# Altium project Ger. abastecimento.PrjPcb
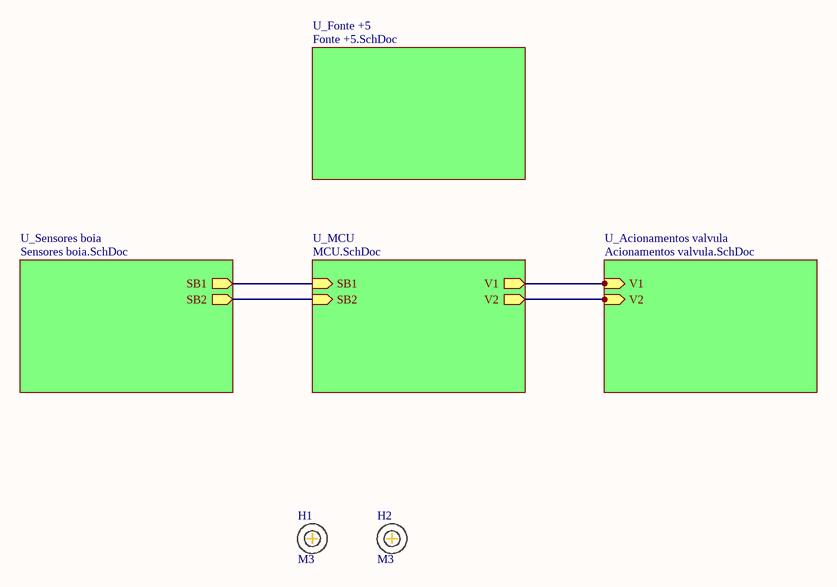
[diagram p0: Main.SchDoc]
ApprovedBy: Douglas Felipé; =ProjectName: Ger. abastecimento
5 sheets, 43 parts. Net scope: hierarchical (ports join the sheet entries above them; power ports are global).
Board file: PCB Ger_Abs.PcbDoc
Sheets:
  Main.SchDoc
    U_Acionamentos valvula = Acionamentos valvula.SchDoc
    U_Fonte +5 = Fonte +5.SchDoc
    U_MCU = MCU.SchDoc
    U_Sensores boia = Sensores boia.SchDoc

## Sheet Main.SchDoc: Main
size A4; ApprovedBy: Douglas Felipe; Author: Douglas Felipe; DocumentNumber: GERABS01; Revision: 1.0; SheetNumber: 1; SheetTotal: 5

### Parts
H1  M3  [Parafuso M2]
H2  M3  [Parafuso M2]

### Sub-sheets
U_Acionamentos valvula = Acionamentos valvula.SchDoc: V1 (in), V2 (in)
U_Fonte +5 = Fonte +5.SchDoc: no entries
U_MCU = MCU.SchDoc: SB1 (in), SB2 (in), V1 (out), V2 (out)
U_Sensores boia = Sensores boia.SchDoc: SB1 (out), SB2 (out)

### Nets
NetC6_1: sheet U_MCU/SB1, sheet U_Sensores boia/SB1
NetC8_1: sheet U_MCU/SB2, sheet U_Sensores boia/SB2
NetR5_1: sheet U_Acionamentos valvula/V1, sheet U_MCU/V1
NetR6_1: sheet U_Acionamentos valvula/V2, sheet U_MCU/V2

### Notes on the sheet
- PROJETO
- REV
- TITULO
- PÁG
- DE
- NÚMERO
- DESIGNER
- REVISADO POR
- DATA
- ARQUIVO
- TAMANHO
- A4

### Library data of the parts
H1 H2 = Furo M2

## Sheet Acionamentos valvula.SchDoc: Acionamento valvulas
size A4; Date: 22/04/2023; ApprovedBy: Douglas F.; Author: Douglas F.; DocumentNumber: GERABS01; Revision: 1.0; SheetNumber: 3; SheetTotal: 4; Application_BuildNumber: GerAbs01
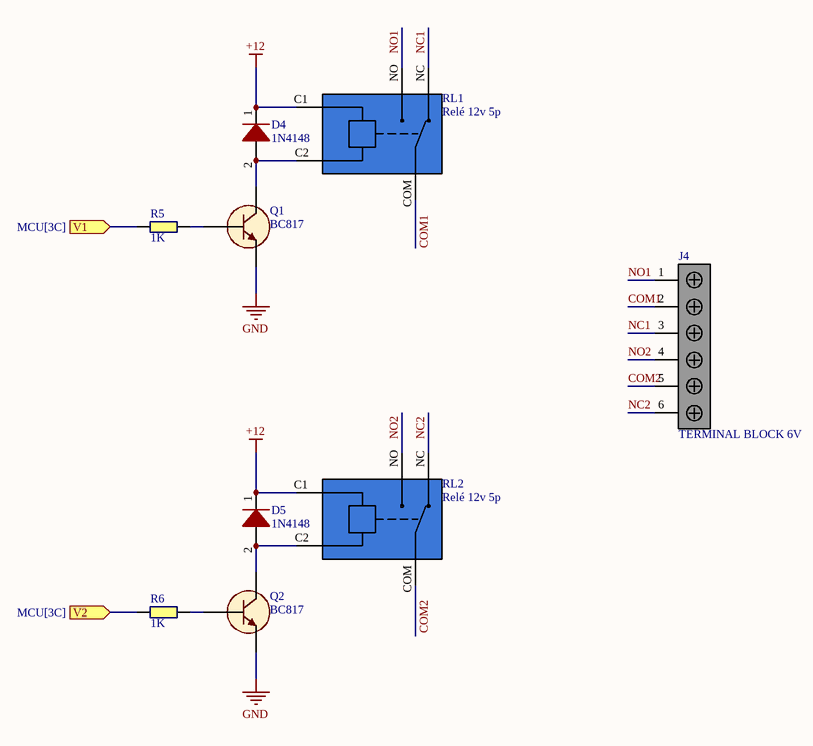
[diagram p1: Acionamentos valvula.SchDoc]

### Parts
D4  1N4148  [DIOMELF3516N]
D5  1N4148  [DIOMELF3516N]
J4  TERMINAL BLOCK 6V  [Terminal block 5mm 6V]
Q1  BC817  [SOT23]
Q2  BC817  [SOT23]
R5  1K  [RESISTOR 1/4W 0805]
R6  1K  [RESISTOR 1/4W 0805]
RL1  Relé 12v 5p  [RELAY]
RL2  Relé 12v 5p  [RELAY]

### Ports
V1 (in, see MCU[3C]), V2 (in, see MCU[3C])

### Nets
+12: D4.1 D5.1 RL1.C1(COIL_1) RL2.C1(COIL_1)
GND: Q1.2(E) Q2.2(E)
COM1: J4.2 RL1.COM
COM2: J4.5 RL2.COM
NC1: J4.3 RL1.NC
NC2: J4.6 RL2.NC
NO1: J4.1 RL1.NO
NO2: J4.4 RL2.NO
NetD4_2: D4.2 Q1.3(C) RL1.C2(COIL_2)
NetD5_2: D5.2 Q2.3(C) RL2.C2(COIL_2)
NetQ1_1: Q1.1(B) R5.2
NetQ2_1: Q2.1(B) R6.2
NetR5_1: R5.1 ; port V1
NetR6_1: R6.1 ; port V2

### Notes on the sheet
- PROJETO
- REV
- TITULO
- PÁG
- DE
- NÚMERO
- DESIGNER
- REVISADO POR
- DATA
- ARQUIVO
- TAMANHO
- A4

### Library data of the parts
D4 D5 = DIODO 1N4148: Diodo rapido; Published: 8-Jun-2000; LatestRevisionDate: 17-Jul-2002; LatestRevisionNote: Re-released for DXP Platform.; DatasheetVersion: 1997; PackageReference: DO-35; Publisher: Altium Limited; PackageDescription: Diode, Axial; Body 3.8 x 1.9 mm (LxDia. max), Lead Dia. 0.53 mm (max); Code_JEDEC: DO-204-AH; ComponentLink1Description: Manufacturer Link; ComponentLink1URL: http://www.fairchildsemi.com/; ComponentLink2Description: Datasheet; ComponentLink2URL: http://www.fairchildsemi.com/ds/1N%2F1N4148.pdf
J4 = TERMINAL BLOCK 6V: Block, Terminal; 6 A; 63 V; 5 mm; 26 to 20 AWG; 6 Screw; Soldering; 1.5 kV
R5 R6 = RESISTOR 1/4W: Resistor; Published: 8-Jun-2000; LatestRevisionDate: 17-Jul-2002; LatestRevisionNote: Re-released for DXP Platform.; PackageReference: AXIAL-0.4; Publisher: Altium Limited; PackageDescription: Axial Device, Thru-Hole; 2 Leads; 0.4 in Pin Spacing

## Sheet Fonte +5.SchDoc: Fonte regulas + 5v
size A4; Date: 22/04/2023; ApprovedBy: Douglas Felipe; Author: Douglas Felipe; DocumentNumber: GERABS01; Revision: 1.0; SheetNumber: 2; SheetTotal: 5
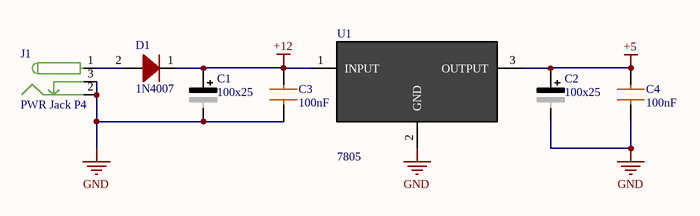
[diagram p2: Fonte +5.SchDoc]

### Parts
C1  100x25  [CAP 100X25 SMD]
C2  100x25  [CAP 100X25 SMD]
C3  100nF  [Capacitor 0805]
C4  100nF  [Capacitor 0805]
D1  1N4007  [SOD123]
J1  PWR Jack P4  [Jack P4 SMT]
U1  7805  [TO252-3]

### Nets
+5: C2.1(+) C4.2 U1.3(OUTPUT)
+12: C1.1(+) C3.2 D1.1 U1.1(INPUT)
GND: C1.2(-) C2.2(-) C3.1 C4.1 J1.2 J1.3 U1.2(GND)
NetD1_2: D1.2 J1.1

### Notes on the sheet
- PROJETO
- REV
- TITULO
- PÁG
- DE
- NÚMERO
- DESIGNER
- REVISADO POR
- DATA
- ARQUIVO
- TAMANHO
- A4

### Library data of the parts
C1 C2 = CAPACITOR ELETROLITICO: Polarized Capacitor (Radial); Published: 8-Jun-2000; LatestRevisionDate: 17-Jul-2002; LatestRevisionNote: Re-released for DXP Platform.; PackageReference: RB7.6-15; Publisher: Altium Limited; PackageDescription: Polarized Capacitor (Radial); 2 Leads
C3 C4 = CAPACITOR: Published: 8-Jun-2000; LatestRevisionDate: 17-Jul-2002; LatestRevisionNote: Re-released for DXP Platform.; PackageReference: RAD-0.3; Publisher: Altium Limited; PackageDescription: Radial Cap, Thru-Hole; 2 Leads; 0.3 in Pin Spacing
D1 = DIODO 1N4007: Diodo retificador de uso geral.; Published: 8-Jun-2000; LatestRevisionDate: 17-Jul-2002; LatestRevisionNote: Re-released for DXP Platform.; DatasheetVersion: 1997; PackageReference: DO-35; Publisher: Altium Limited; PackageDescription: Diode, Axial; Body 3.8 x 1.9 mm (LxDia. max), Lead Dia. 0.53 mm (max); Code_JEDEC: DO-204-AH; ComponentLink1Description: Manufacturer Link; ComponentLink1URL: http://www.fairchildsemi.com/; ComponentLink2Description: Datasheet; ComponentLink2URL: http://www.fairchildsemi.com/ds/1N%2F1N4148.pdf
J1 = PWR Jack P4: Connector Power PL 2 POS Solder RA Thru-Hole 3 Terminal 1 Port Bulk; Manufacturer: Switchcraft; Manufacturer Part Number: RAPC712X; Body Color: Black; Body Material: Thermoplastic; Number of Terminals/Pins: 3; Gender: Male; Shielding: Unshielded; Connector Type: Power,Jack; Current Rating: 5A; Insulation Resistance: 30MR; Number of Contacts: 2; Number of Ports: 1; Pin Diameter: 2.5mm; RoHS: Yes; Category: Connectors; Stock 1: 13399; Pricing 1: 1=1,91000, 10=1,33000, 50=1,33000, 100=1,23000, 1000=1,06000, 10000=1,04000 (USD); Mount: Through Hole,PCB,Panel; Number of Pins: 3; Contact Material: Brass; Contact Plating: Nickel,Silver; Housing Material: Thermoplastic; Color: Black; Housing Color: Black; Packaging: Bulk; Termination: Solder; Package Quantity: 2500; Orientation: Right Angle; Series: -; Contact Gender: Female; Max Current Rating: 5A; Primary Type: POWER; Length: 9mm; Depth: 14.5mm; Lead Free: Lead Free; Flammability Rating: UL94 V-0; RoHS Compliant: Yes; Reach SVHC Compliant: Yes; ComponentLink1URL: https://datasheet.ciiva.com/15173/getdatasheetpartid-110865-15173793.pdf?src-supplier=Verical; ComponentLink1Description: https://datasheet.ciiva.com/15173/getdatasheetpartid-110865-15173793.pdf?src-supplier=Verical; ComponentLink2URL: https://datasheet.ciiva.com/391/rapc712x-cd-391666.pdf?src-supplier=Digi-Key; ComponentLink2Description: https://datasheet.ciiva.com/391/rapc712x-cd-391666.pdf?src-supplier=Digi-Key; Supplier Part Number 1: 502-RAPC712X
U1 = L7805

## Sheet MCU.SchDoc: MCU
size A4; Date: 22/04/2023; ApprovedBy: Douglas Felipe; Author: Douglas Felipe; DocumentNumber: GERABS01; Revision: 1.0; SheetNumber: 5; SheetTotal: 5; Application_BuildNumber: 1.0
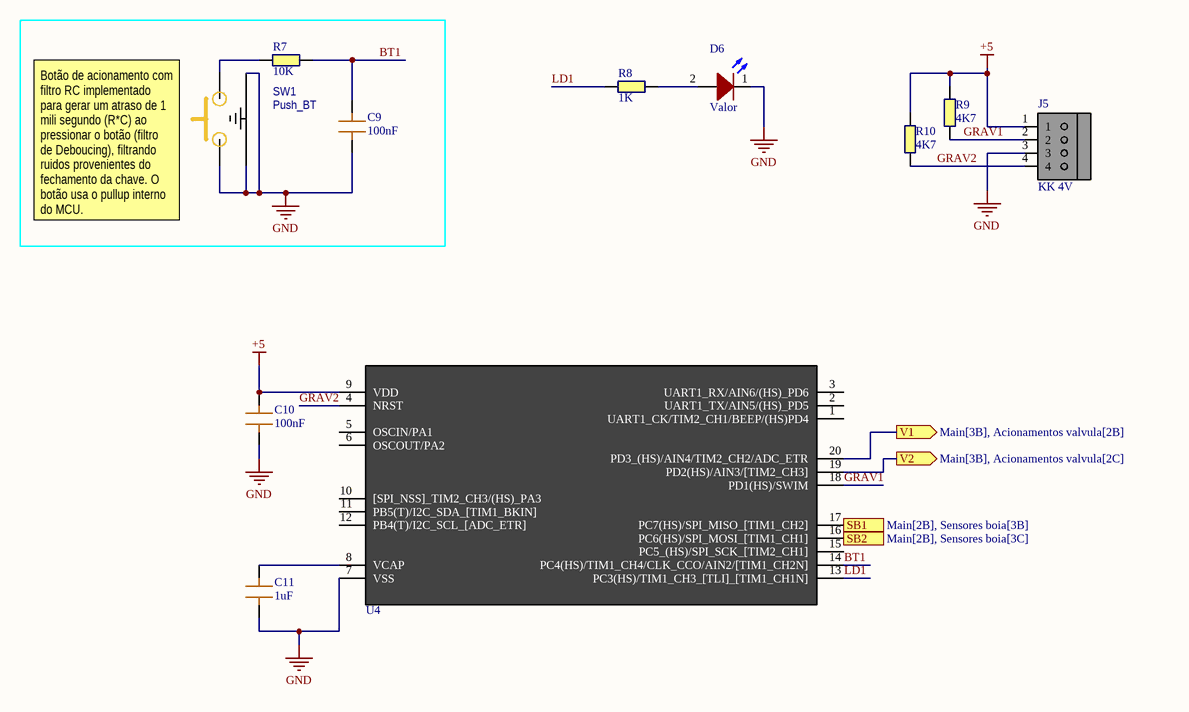
[diagram p3: MCU.SchDoc]

### Parts
C9  100nF  [Capacitor 0805]
C10  100nF  [Capacitor 0805]
C11  1uF  [Capacitor 0805]
D6  Valor  [LED 3MM]
J5  KK 4V  [CONN KK 4 VIAS]
R7  10K  [RESISTOR 1/4W 0805]
R8  1K  [RESISTOR 1/4W 0805]
R9  4K7  [RESISTOR 1/4W 0805]
R10  4K7  [RESISTOR 1/4W 0805]
SW1  Push_BT  [SWITCH 9.5 180]
U4  STM8S003F3P6  [SOP65P640X170-20N]  (value not drawn)

### Ports
SB1 (in, see Main[2B], Sensores boia[3B]), SB2 (in, see Main[2B], Sensores boia[3C]), V1 (out, see Main[3B], Acionamentos valvula[2B]), V2 (out, see Main[3B], Acionamentos valvula[2C])

### Nets
+5: C10.1 J5.1 R9.1 R10.2 U4.9(VDD)
GND: C9.2 C10.2 C11.1 D6.1 J5.3 SW1.1 SW1.3 SW1.4 U4.7(VSS)
BT1: C9.1 R7.1 U4.14(PC4(HS)/TIM1_CH4/CLK_CCO/AIN2/[TIM1_CH2N])
GRAV1: J5.2 R9.2 U4.18(PD1(HS)/SWIM)
GRAV2: J5.4 R10.1 U4.4(NRST)
LD1: R8.2 U4.13(PC3(HS)/TIM1_CH3_[TLI]_[TIM1_CH1N])
NetC6_1: U4.17(PC7(HS)/SPI_MISO_[TIM1_CH2]) ; port SB1
NetC8_1: U4.16(PC6(HS)/SPI_MOSI_[TIM1_CH1]) ; port SB2
NetC11_2: C11.2 U4.8(VCAP)
NetD6_2: D6.2 R8.1
NetR5_1: U4.20(PD3_(HS)/AIN4/TIM2_CH2/ADC_ETR) ; port V1
NetR6_1: U4.19(PD2(HS)/AIN3/[TIM2_CH3]) ; port V2
NetR7_2: R7.2 SW1.2

Not connected (* = marked no-connect by the designer): U4 1(UART1_CK/TIM2_CH1/BEEP/(HS)PD4) 2(UART1_TX/AIN5/(HS)_PD5) 3(UART1_RX/AIN6/(HS)_PD6) 5(OSCIN/PA1) 6(OSCOUT/PA2) 10([SPI_NSS]_TIM2_CH3/(HS)_PA3) 11(PB5(T)/I2C_SDA_[TIM1_BKIN]) 12(PB4(T)/I2C_SCL_[ADC_ETR]) 15(PC5_(HS)/SPI_SCK_[TIM2_CH1])

### Notes on the sheet
- (near SW1) Botão de acionamento com filtro RC implementado para gerar um atraso de 1 mili segundo (R*C) ao pressionar o botão (filtro de Deboucing), filtrando ruidos provenientes do fechamento da chave. O botão usa o pullup interno do MCU.
- PROJETO
- REV
- TITULO
- PÁG
- DE
- NÚMERO
- DESIGNER
- REVISADO POR
- DATA
- ARQUIVO
- TAMANHO
- A4

### Library data of the parts
C9-C11 = CAPACITOR: Published: 8-Jun-2000; LatestRevisionDate: 17-Jul-2002; LatestRevisionNote: Re-released for DXP Platform.; PackageReference: RAD-0.3; Publisher: Altium Limited; PackageDescription: Radial Cap, Thru-Hole; 2 Leads; 0.3 in Pin Spacing
D6 = LED: Typical RED, GREEN, YELLOW, AMBER GaAs LED; Published: 8-Jun-2000; LatestRevisionDate: 17-Jul-2002; LatestRevisionNote: Re-released for DXP Platform.; PackageVersion: Feb-2002; PackageReference: 3.2X1.6X1.1; Publisher: Altium Limited; PackageDescription: SM LED; 2 Flat Leads
J5 = KK 4 vias
R7-R10 = RESISTOR 1/4W: Resistor; Published: 8-Jun-2000; LatestRevisionDate: 17-Jul-2002; LatestRevisionNote: Re-released for DXP Platform.; PackageReference: AXIAL-0.4; Publisher: Altium Limited; PackageDescription: Axial Device, Thru-Hole; 2 Leads; 0.4 in Pin Spacing
U4 = STM8S003F3P6: STMICROELECTRONICS - STM8S003F3P6 - MCU, 8BIT, STM8, 16MHZ, TSSOP-20; Geometry.Height: 1.2mm; Mouser Part Number: 511-STM8S003F3P6; Mouser Price/Stock: https://www.mouser.co.uk/ProductDetail/STMicroelectronics/STM8S003F3P6?qs=vV0pr1uq7fD%252BGii5YhjnYw%3D%3D; Manufacturer_Name: STMicroelectronics; Manufacturer_Part_Number: STM8S003F3P6; Datasheet Link: http://www.st.com/web/en/resource/technical/document/datasheet/DM00024550.pdf

## Sheet Sensores boia.SchDoc: Sensores boia
size A4; Date: 22/04/2023; ApprovedBy: Douglas Felipe; Author: Douglas Felipe; DocumentNumber: GERABS01; Revision: 1.0; SheetNumber: 2; SheetTotal: 4
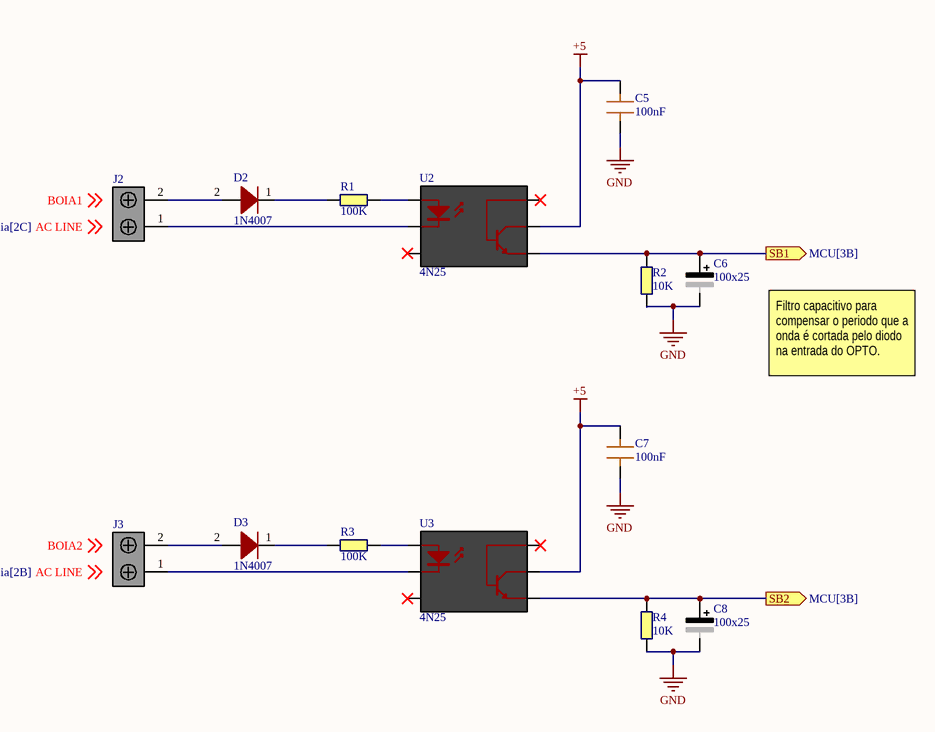
[diagram p4: Sensores boia.SchDoc]

### Parts
C5  100nF  [Capacitor 0805]
C6  100x25  [CAP 100X25 SMD]
C7  100nF  [Capacitor 0805]
C8  100x25  [CAP 100X25 SMD]
D2  1N4007  [SOD123]
D3  1N4007  [SOD123]
J2  Conector 2v Phoenix  [Terminal block 5mm 2V]  (value not drawn)
J3  Conector 2v Phoenix  [Terminal block 5mm 2V]  (value not drawn)
R1  100K  [RESISTOR 1W 2512]
R2  10K  [RESISTOR 1/4W 0805]
R3  100K  [RESISTOR 1W 2512]
R4  10K  [RESISTOR 1/4W 0805]
U2  4N25  [4N25]
U3  4N25  [4N25]

### Ports
SB1 (out, see MCU[3B]), SB2 (out, see MCU[3B])

### Nets
+5: C5.2 C7.2 U2.5(C) U3.5(C)
GND: C5.1 C6.2(-) C7.1 C8.2(-) R2.1 R4.1
NetC6_1: C6.1(+) R2.2 U2.6(B) ; port SB1
NetC8_1: C8.1(+) R4.2 U3.6(B) ; port SB2
NetD2_1: D2.1 R1.1
NetD2_2: D2.2 J2.2
NetD3_1: D3.1 R3.1
NetD3_2: D3.2 J3.2
NetJ2_1: J2.1 U2.2(K)
NetJ3_1: J3.1 U3.2(K)
NetR1_2: R1.2 U2.1(A)
NetR3_2: R3.2 U3.1(A)

Not connected (* = marked no-connect by the designer): U2 3(NC)*; U3 3(NC)*

### Notes on the sheet
- Filtro capacitivo para compensar o periodo que a onda é cortada pelo diodo na entrada do OPTO.
- Labels drawn without touching a wire or pin: AC LINE, BOIA1, BOIA2
- PROJETO
- REV
- TITULO
- PÁG
- DE
- NÚMERO
- DESIGNER
- REVISADO POR
- DATA
- ARQUIVO
- TAMANHO
- A4

### Library data of the parts
C5 C7 = CAPACITOR: Published: 8-Jun-2000; LatestRevisionDate: 17-Jul-2002; LatestRevisionNote: Re-released for DXP Platform.; PackageReference: RAD-0.3; Publisher: Altium Limited; PackageDescription: Radial Cap, Thru-Hole; 2 Leads; 0.3 in Pin Spacing
C6 C8 = CAPACITOR ELETROLITICO: Polarized Capacitor (Radial); Published: 8-Jun-2000; LatestRevisionDate: 17-Jul-2002; LatestRevisionNote: Re-released for DXP Platform.; PackageReference: RB7.6-15; Publisher: Altium Limited; PackageDescription: Polarized Capacitor (Radial); 2 Leads
D2 D3 = DIODO 1N4007: Diodo retificador de uso geral.; Published: 8-Jun-2000; LatestRevisionDate: 17-Jul-2002; LatestRevisionNote: Re-released for DXP Platform.; DatasheetVersion: 1997; PackageReference: DO-35; Publisher: Altium Limited; PackageDescription: Diode, Axial; Body 3.8 x 1.9 mm (LxDia. max), Lead Dia. 0.53 mm (max); Code_JEDEC: DO-204-AH; ComponentLink1Description: Manufacturer Link; ComponentLink1URL: http://www.fairchildsemi.com/; ComponentLink2Description: Datasheet; ComponentLink2URL: http://www.fairchildsemi.com/ds/1N%2F1N4148.pdf
J2 J3 = TERMINAL BLOCK 2V: Block, Terminal; 6 A; 63 V; 5 mm; 26 to 20 AWG; 2; Screw; Soldering; 1.5 kV; Manufacturer: Phoenix Contact; Manufacturer Part Number: 1725656; Current Rating: 6A; Voltage Rating: 125V; Number of Positions: 2; Number of Levels: 1; Connector Type: Screw,PCB,Terminal Block; Max Supply Voltage: 63V; Pitch: 2.54mm; Wire Gauge (Max): 26AWG; Wire Gauge (Min): 20AWG; Stripping Length: 4.5mm; Approvals: UL,CSA,cULus,EAC; RoHS: Yes; Category: Terminal Blocks; Stock 1: 29866; Pricing 1: 1=1,94000, 10=1,76000, 50=1,69000, 100=1,64000, 1000=1,27000, 10000=1,17000 (USD); Mount: Through Hole; Number of Pins: 2; Contact Material: Tin; Weight: 0.022575oz; Housing Material: Polyamide; Color: Green; Housing Color: Green; Insulation Material: Nylon; Package Quantity: 50; Packaging: Bulk; Termination: Solder; Series: MPT; Max Current Rating: 6A; Number of Contacts: 2; Number of Rows: 1; Number of Positions Per Level: 2; Current: 6A; Voltage: 125V; Orientation: Straight; Number of Poles: 2; Number of Circuits: 2; Length: 5.54mm; Width: 12mm; Height: 6.2mm; Depth: 6.2mm; Wire/Cable Gauge: 26AWG; Radiation Hardening: No; RoHS Compliant: Yes; Lead Free: Lead Free; Flammability Rating: UL94 V-0; Reach SVHC Compliant: Yes; ComponentLink1URL: https://datasheet.ciiva.com/16071/1725656-16071846.pdf?src-supplier=Onlinecomponents.com; ComponentLink1Description: https://datasheet.ciiva.com/16071/1725656-16071846.pdf?src-supplier=Onlinecomponents.com; ComponentLink2URL: https://datasheet.ciiva.com/15169/getdatasheetpartid-199323-15169849.pdf?src-supplier=Verical; ComponentLink2Description: https://datasheet.ciiva.com/15169/getdatasheetpartid-199323-15169849.pdf?src-supplier=Verical; ComponentLink3URL: https://datasheet.ciiva.com/823/1725656-823793.pdf?src-supplier=Digi-Key; ComponentLink3Description: https://datasheet.ciiva.com/823/1725656-823793.pdf?src-supplier=Digi-Key; ComponentLink4URL: https://datasheet.ciiva.com/1120/319957-1120510.pdf?src-supplier=Farnell; ComponentLink4Description: https://datasheet.ciiva.com/1120/319957-1120510.pdf?src-supplier=Farnell; ComponentLink5URL: https://datasheet.ciiva.com/26340/788052-da-01-en-100ntklemme-1725656-250-st-26340907.pdf?src-supplier=Conrad; ComponentLink5Description: https://datasheet.ciiva.com/26340/788052-da-01-en-100ntklemme-1725656-250-st-26340907.pdf?src-supplier=Conrad; Supplier Part Number 1: 651-1725656
R1 R3 = RESISTOR 1W: Resistor; Published: 8-Jun-2000; LatestRevisionDate: 17-Jul-2002; LatestRevisionNote: Re-released for DXP Platform.; PackageReference: AXIAL-0.4; Publisher: Altium Limited; PackageDescription: Axial Device, Thru-Hole; 2 Leads; 0.4 in Pin Spacing
R2 R4 = RESISTOR 1/4W: Resistor; Published: 8-Jun-2000; LatestRevisionDate: 17-Jul-2002; LatestRevisionNote: Re-released for DXP Platform.; PackageReference: AXIAL-0.4; Publisher: Altium Limited; PackageDescription: Axial Device, Thru-Hole; 2 Leads; 0.4 in Pin Spacing

## Nets that join several sheets
+5: Fonte +5 (C2.1 C4.2 U1.3), MCU (5 pins), Sensores boia (C5.2 C7.2 U2.5 U3.5)
+12: Acionamentos valvula (D4.1 D5.1 RL1.C1 RL2.C1), Fonte +5 (C1.1 C3.2 D1.1 U1.1)
GND: Acionamentos valvula (Q1.2 Q2.2), Fonte +5 (7 pins), MCU (9 pins), Sensores boia (6 pins)
NetC6_1: MCU (U4.17), Sensores boia (C6.1 R2.2 U2.6)
NetC8_1: MCU (U4.16), Sensores boia (C8.1 R4.2 U3.6)
NetR5_1: Acionamentos valvula (R5.1), MCU (U4.20)
NetR6_1: Acionamentos valvula (R6.1), MCU (U4.19)